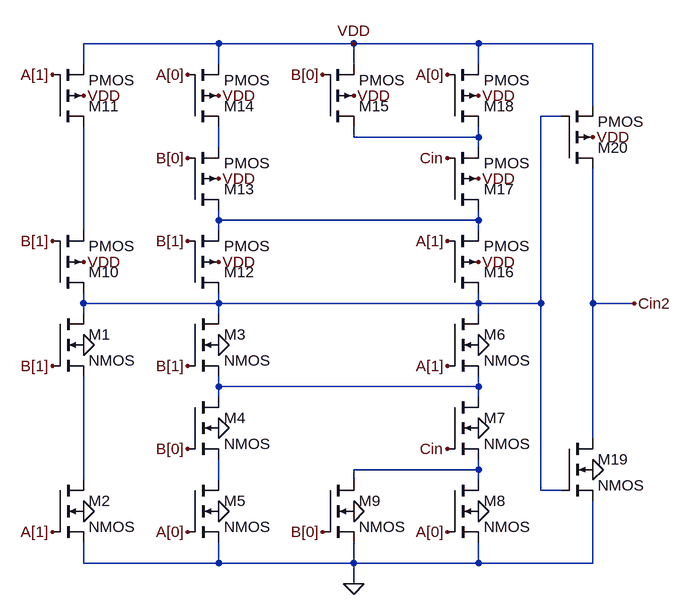
[diagram p0: schematic Carry_in2.asc]
Carry_in2.asc, the LTspice schematic file:
Version 4
SHEET 1 880 680
WIRE -16 -352 -224 -352
WIRE 192 -352 -16 -352
WIRE 384 -352 192 -352
WIRE 560 -352 384 -352
WIRE -224 -320 -224 -352
WIRE -16 -320 -16 -352
WIRE 192 -320 192 -352
WIRE 384 -320 384 -352
WIRE 560 -256 560 -352
WIRE 512 -240 480 -240
WIRE 192 -208 192 -224
WIRE 384 -208 384 -224
WIRE 384 -208 192 -208
WIRE -16 -192 -16 -224
WIRE 384 -192 384 -208
WIRE -16 -80 -16 -96
WIRE 384 -80 384 -96
WIRE 384 -80 -16 -80
WIRE -224 -64 -224 -224
WIRE -16 -64 -16 -80
WIRE 384 -64 384 -80
WIRE -224 48 -224 32
WIRE -16 48 -16 32
WIRE -16 48 -224 48
WIRE 384 48 384 32
WIRE 384 48 -16 48
WIRE 480 48 480 -240
WIRE 480 48 384 48
WIRE 560 48 560 -160
WIRE 624 48 560 48
WIRE -224 64 -224 48
WIRE -16 64 -16 48
WIRE 384 64 384 48
WIRE -16 176 -16 160
WIRE 384 176 384 160
WIRE 384 176 -16 176
WIRE -16 192 -16 176
WIRE 384 192 384 176
WIRE 560 256 560 48
WIRE 384 304 384 288
WIRE 384 304 192 304
WIRE -224 320 -224 160
WIRE -16 320 -16 288
WIRE 192 320 192 304
WIRE 384 320 384 304
WIRE 480 336 480 48
WIRE 512 336 480 336
WIRE -224 448 -224 416
WIRE -16 448 -16 416
WIRE -16 448 -224 448
WIRE 192 448 192 416
WIRE 192 448 -16 448
WIRE 384 448 384 416
WIRE 384 448 192 448
WIRE 560 448 560 352
WIRE 560 448 384 448
WIRE 192 480 192 448
FLAG -272 -304 A[1]
FLAG -272 400 A[1]
FLAG 336 144 A[1]
FLAG 336 -48 A[1]
FLAG 336 -304 A[0]
FLAG 336 400 A[0]
FLAG -64 400 A[0]
FLAG -64 -304 A[0]
FLAG 144 -304 B[0]
FLAG 144 400 B[0]
FLAG -64 272 B[0]
FLAG -64 -176 B[0]
FLAG -64 -48 B[1]
FLAG -64 144 B[1]
FLAG -272 -48 B[1]
FLAG -272 144 B[1]
FLAG 336 272 Cin
FLAG 336 -176 Cin
FLAG 560 304 0
FLAG 384 112 0
FLAG 384 240 0
FLAG 384 368 0
FLAG 192 368 0
FLAG -16 112 0
FLAG -16 240 0
FLAG -16 368 0
FLAG -224 368 0
FLAG -224 112 0
FLAG -224 -272 VDD
FLAG -224 -16 VDD
FLAG -16 -16 VDD
FLAG -16 -144 VDD
FLAG -16 -272 VDD
FLAG 192 -272 VDD
FLAG 384 -272 VDD
FLAG 384 -144 VDD
FLAG 384 -16 VDD
FLAG 560 -208 VDD
FLAG 192 480 0
FLAG 192 -352 VDD
FLAG 624 48 Cin2
SYMBOL nmos4 -272 64 R0
SYMATTR InstName M1
SYMBOL nmos4 -272 320 R0
SYMATTR InstName M2
SYMBOL nmos4 -64 64 R0
SYMATTR InstName M3
SYMBOL nmos4 -64 192 R0
SYMATTR InstName M4
SYMBOL nmos4 -64 320 R0
SYMATTR InstName M5
SYMBOL nmos4 336 64 R0
SYMATTR InstName M6
SYMBOL nmos4 336 192 R0
SYMATTR InstName M7
SYMBOL nmos4 336 320 R0
SYMATTR InstName M8
SYMBOL nmos4 144 320 R0
SYMATTR InstName M9
SYMBOL pmos4 -272 32 M180
SYMATTR InstName M10
SYMBOL pmos4 -272 -224 M180
SYMATTR InstName M11
SYMBOL pmos4 -64 32 M180
SYMATTR InstName M12
SYMBOL pmos4 -64 -96 M180
SYMATTR InstName M13
SYMBOL pmos4 -64 -224 M180
SYMATTR InstName M14
SYMBOL pmos4 144 -224 M180
SYMATTR InstName M15
SYMBOL pmos4 336 32 M180
SYMATTR InstName M16
SYMBOL pmos4 336 -96 M180
SYMATTR InstName M17
SYMBOL pmos4 336 -224 M180
SYMATTR InstName M18
SYMBOL nmos4 512 256 R0
SYMATTR InstName M19
SYMBOL pmos4 512 -160 M180
SYMATTR InstName M20

The netlist it stands for:
* Carry_in2.asc
M1 N001 B[1] N008 0 NMOS
M2 N008 A[1] 0 0 NMOS
M3 N001 B[1] N006 0 NMOS
M4 N006 B[0] N009 0 NMOS
M5 N009 A[0] 0 0 NMOS
M6 N001 A[1] N006 0 NMOS
M7 N006 Cin N007 0 NMOS
M8 N007 A[0] 0 0 NMOS
M9 N007 B[0] 0 0 NMOS
M10 N001 B[1] N005 VDD PMOS
M11 N005 A[1] VDD VDD PMOS
M12 N001 B[1] N004 VDD PMOS
M13 N004 B[0] N003 VDD PMOS
M14 N003 A[0] VDD VDD PMOS
M15 N002 B[0] VDD VDD PMOS
M16 N001 A[1] N004 VDD PMOS
M17 N004 Cin N002 VDD PMOS
M18 N002 A[0] VDD VDD PMOS
M19 Cin2 N001 0 0 NMOS
M20 Cin2 N001 VDD VDD PMOS
.model NMOS NMOS
.model PMOS PMOS
.lib standard.mos
.backanno
.end